# EAGLE design MS_20_Filter_Geetah (EAGLE 9.6.0)
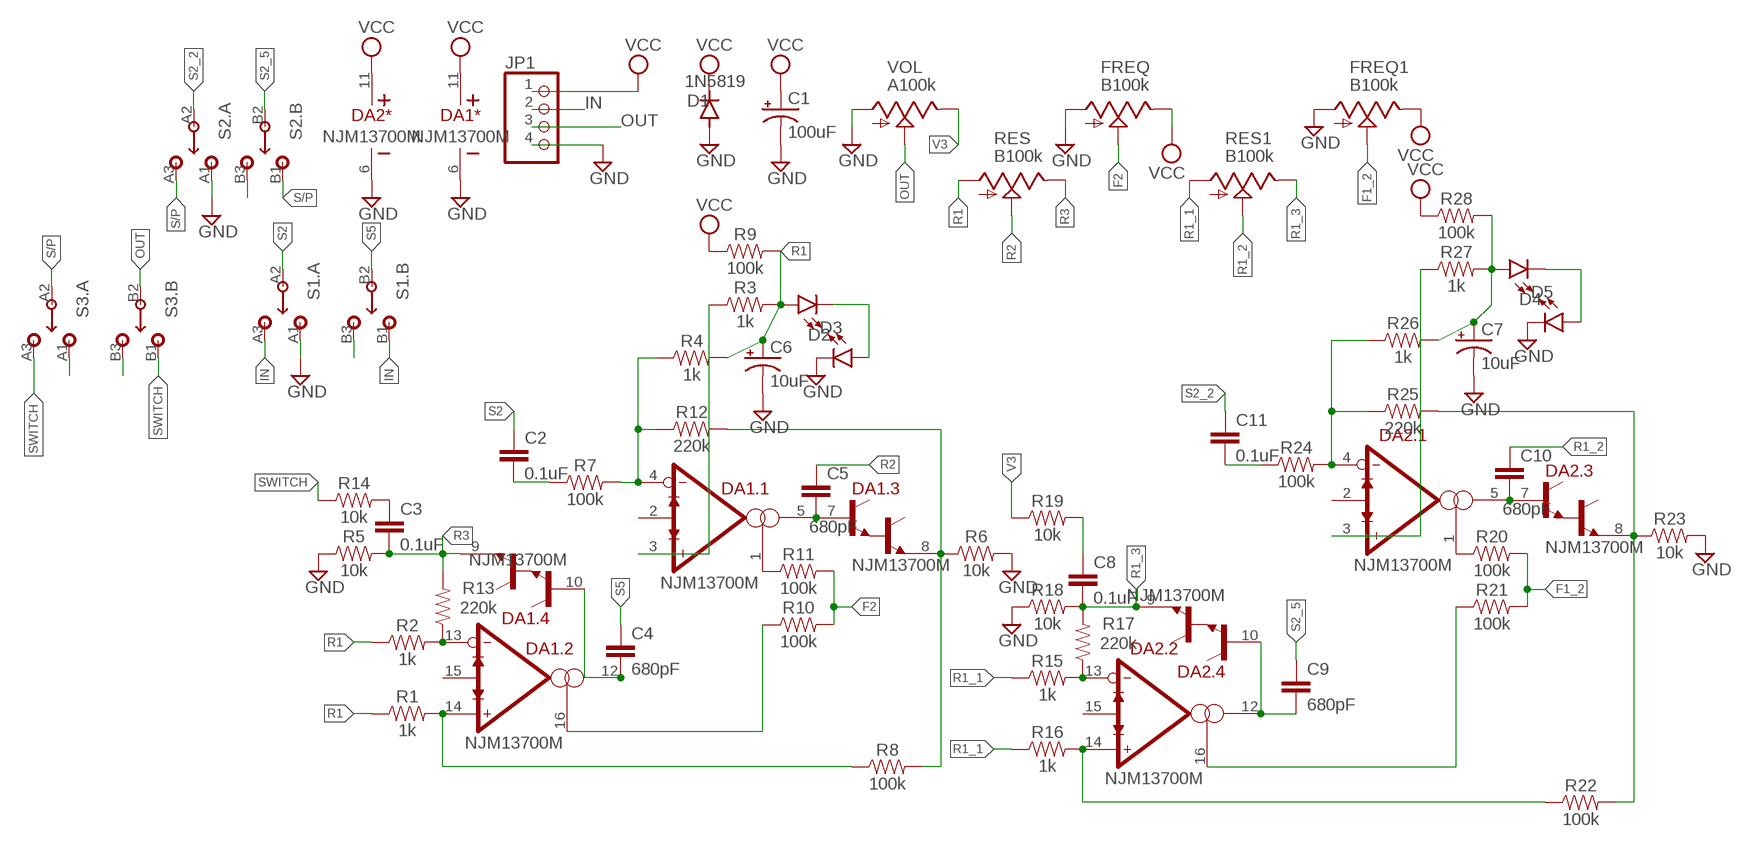
[diagram p0: schematic, sheet 1]

## Parts
C1  100uF  CAP_SMD+THRUPAN_B  [PAN_B_SMD+THRU]
C2  0.1uF  0.1UF-0603-25V-(+80/-20%)  [0603]
C3  0.1uF  0.1UF-0603-25V-(+80/-20%)  [0603]
C4  680pF  680PF-0603-50V-10%  [0603]
C5  680pF  680PF-0603-50V-10%  [0603]
C6  10uF  CAP_SMD+THRUPAN_B  [PAN_B_SMD+THRU]
C7  10uF  CAP_SMD+THRUPAN_B  [PAN_B_SMD+THRU]
C8  0.1uF  0.1UF-0603-25V-(+80/-20%)  [0603]
C9  680pF  680PF-0603-50V-10%  [0603]
C10  680pF  680PF-0603-50V-10%  [0603]
C11  0.1uF  0.1UF-0603-25V-(+80/-20%)  [0603]
D1  1N5819  DIODE-SOD123  [SOD123]
D2  LED-FKIT-1206  [FKIT-LED-1206]
D3  LED-FKIT-1206  [FKIT-LED-1206]
D4  LED-FKIT-1206  [FKIT-LED-1206]
D5  LED-FKIT-1206  [FKIT-LED-1206]
DA1  NJM13700M  [SO-16]
DA2  NJM13700M  [SO-16]
FREQ  B100k  9MM_SNAP-IN_POT_  [9MM_SNAP-IN_POT]
FREQ1  B100k  9MM_SNAP-IN_POT_  [9MM_SNAP-IN_POT]
JP1  PINHD-1X4  [1X04]
R1  1k  1KOHM-0603-1/10W-1%  [0603]
R2  1k  1KOHM-0603-1/10W-1%  [0603]
R3  1k  1KOHM-0603-1/10W-1%  [0603]
R4  1k  1KOHM-0603-1/10W-1%  [0603]
R5  10k  10KOHM-0603-1/10W-1%  [0603]
R6  10k  10KOHM-0603-1/10W-1%  [0603]
R7  100k  100KOHM-0603-1/10W-1%  [0603]
R8  100k  100KOHM-0603-1/10W-1%  [0603]
R9  100k  100KOHM-0603-1/10W-1%  [0603]
R10  100k  100KOHM-0603-1/10W-1%  [0603]
R11  100k  100KOHM-0603-1/10W-1%  [0603]
R12  220k  220KOHM-0603-1/10W-1%  [0603]
R13  220k  220KOHM-0603-1/10W-1%  [0603]
R14  10k  10KOHM-0603-1/10W-1%  [0603]
R15  1k  1KOHM-0603-1/10W-1%  [0603]
R16  1k  1KOHM-0603-1/10W-1%  [0603]
R17  220k  220KOHM-0603-1/10W-1%  [0603]
R18  10k  10KOHM-0603-1/10W-1%  [0603]
R19  10k  10KOHM-0603-1/10W-1%  [0603]
R20  100k  100KOHM-0603-1/10W-1%  [0603]
R21  100k  100KOHM-0603-1/10W-1%  [0603]
R22  100k  100KOHM-0603-1/10W-1%  [0603]
R23  10k  10KOHM-0603-1/10W-1%  [0603]
R24  100k  100KOHM-0603-1/10W-1%  [0603]
R25  220k  220KOHM-0603-1/10W-1%  [0603]
R26  1k  1KOHM-0603-1/10W-1%  [0603]
R27  1k  1KOHM-0603-1/10W-1%  [0603]
R28  100k  100KOHM-0603-1/10W-1%  [0603]
RES  B100k  9MM_SNAP-IN_POT_  [9MM_SNAP-IN_POT]
RES1  B100k  9MM_SNAP-IN_POT_  [9MM_SNAP-IN_POT]
S1  DPDT.LUGS  [DPDT.LUGS]
S2  DPDT.LUGS  [DPDT.LUGS]
S3  DPDT.LUGS  [DPDT.LUGS]
VOL  A100k  9MM_SNAP-IN_POT_  [9MM_SNAP-IN_POT]

## Nets
F1_2: FREQ1.2(S) R20.2 R21.2
F2: FREQ.2(S) R10.2 R11.2
GND: C1.- C1.--(-) C6.- C6.--(-) C7.- C7.--(-) D1.A D3.C D5.C DA1.6(*:V-) DA2.6(*:V-) FREQ1.1(A) FREQ.1(A) JP1.4 R5.1 R6.2 R18.1 R23.2 S1.A1 S2.A1 VOL.1(A)
IN: JP1.2 S1.A3 S1.B1
N$1: C2.2 R7.1
N$2: DA1.4(.1:IN-) R4.1 R7.2 R12.1
N$3: DA1.1(.1:AMP_BIAS) R11.1
N$4: C5.2 DA1.5(.1:OUT) DA1.7(.3:B)
N$5: DA1.8(.3:E) R6.1 R8.2 R12.2
N$6: DA1.3(.1:IN+) R3.1
N$7: DA1.16(.2:AMP_BIAS) R10.1
N$8: D2.C D3.A
N$9: C4.2 DA1.10(.4:B) DA1.12(.2:OUT)
N$10: DA1.13(.2:IN-) R2.2 R13.1
N$11: C3.1 R14.2
N$12: DA1.14(.2:IN+) R1.2 R8.1
N$14: S2.B3
N$15: DA2.13(.2:IN-) R15.2 R17.1
N$16: S1.B3
N$17: DA2.14(.2:IN+) R16.2 R22.1
N$18: S3.A1
N$19: C8.1 R19.2
N$20: DA2.1(.1:AMP_BIAS) R20.1
N$21: C9.2 DA2.10(.4:B) DA2.12(.2:OUT)
N$22: DA2.16(.2:AMP_BIAS) R21.1
N$23: C10.2 DA2.5(.1:OUT) DA2.7(.3:B)
N$24: DA2.8(.3:E) R22.2 R23.1 R25.2
N$25: DA2.4(.1:IN-) R24.2 R25.1 R26.1
N$26: C11.2 R24.1
N$27: S3.B3
N$29: DA2.3(.1:IN+) R27.1
N$30: D4.C D5.A
N$31: C7.+ C7.++(+) D4.A R26.2 R27.2 R28.2
OUT: JP1.3 S3.B2 VOL.2(S)
R1: C6.+ C6.++(+) D2.A R1.1 R2.1 R3.2 R4.2 R9.2 RES.1(A)
R1_1: R15.1 R16.1 RES1.1(A)
R1_2: C10.1 RES1.2(S)
R1_3: C8.2 DA2.9(.4:E) R17.2 R18.2 RES1.3(E)
R2: C5.1 RES.2(S)
R3: C3.2 DA1.9(.4:E) R5.2 R13.2 RES.3(E)
S2: C2.1 S1.A2
S2_2: C11.1 S2.A2
S2_5: C9.1 S2.B2
S5: C4.1 S1.B2
S/P: S2.A3 S2.B1 S3.A2
SWITCH: R14.1 S3.A3 S3.B1
V3: R19.1 VOL.3(E)
VCC: C1.+ C1.++(+) D1.C DA1.11(*:V+) DA2.11(*:V+) FREQ1.3(E) FREQ.3(E) JP1.1 R9.1 R28.1
Unconnected: DA1.2(.1:DIODE_BIAS) DA1.15(.2:DIODE_BIAS) DA2.2(.1:DIODE_BIAS) DA2.15(.2:DIODE_BIAS)

## Library data of the parts
C1 C6 C7 = MusicThingModular:CAP_SMD+THRU
C2 C3 C8 C11 = SparkFun-Capacitors:0.1UF: 0.1µF ceramic capacitors A capacitor is a passive two-terminal electrical component used to store electrical energy temporarily in an electric field.; PROD_ID: CAP-00810
C4 C5 C9 C10 = SparkFun-Capacitors:680PF: 680pF/0.68nF ceramic capacitors A capacitor is a passive two-terminal electrical component used to store electrical energy temporarily in an electric field.; PROD_ID: CAP-09232
D1 = diode:DIODE-: DIODE
D2-D5 = SparkFun-LED:LED: LED (Generic) Standard schematic elements and footprints for 5mm, 3mm, 1206, and 0603 sized LEDs. Generic LEDs with no color specified.
DA1 DA2 = ic-jrc:NJM13700
FREQ FREQ1 RES RES1 VOL = MusicThingModular:9MM_SNAP-IN_POT: 9mm vertical snap-in pot, Alpha / Panasonic style
JP1 = Connector:PINHD-1X4: PIN HEADER; CATEGORY: CONNECTOR; SUB-CATEGORY: PIN-HEADER
R1-R4 R15 R16 R26 R27 = SparkFun-Resistors:1KOHM: 1kΩ resistor A resistor is a passive two-terminal electrical component that implements electrical resistance as a circuit element. Resistors act to reduce current flow, and, at the same time, act to lower voltage levels within circuits. - Wikipedia; PROD_ID: RES-07856
R5 R6 R14 R18 R19 R23 = SparkFun-Resistors:10KOHM: 10kΩ resistor A resistor is a passive two-terminal electrical component that implements electrical resistance as a circuit element. Resistors act to reduce current flow, and, at the same time, act to lower voltage levels within circuits. - Wikipedia; PROD_ID: RES-00824
R7-R11 R20-R22 R24 R28 = SparkFun-Resistors:100KOHM: 100kΩ resistor A resistor is a passive two-terminal electrical component that implements electrical resistance as a circuit element. Resistors act to reduce current flow, and, at the same time, act to lower voltage levels within circuits. - Wikipedia; PROD_ID: RES-07828
R12 R13 R17 R25 = SparkFun-Resistors:220KOHM: 220kΩ resistor A resistor is a passive two-terminal electrical component that implements electrical resistance as a circuit element. Resistors act to reduce current flow, and, at the same time, act to lower voltage levels within circuits. - Wikipedia; PROD_ID: RES-08969
S1-S3 = switches:DPDT: DPDT Switches

## Board
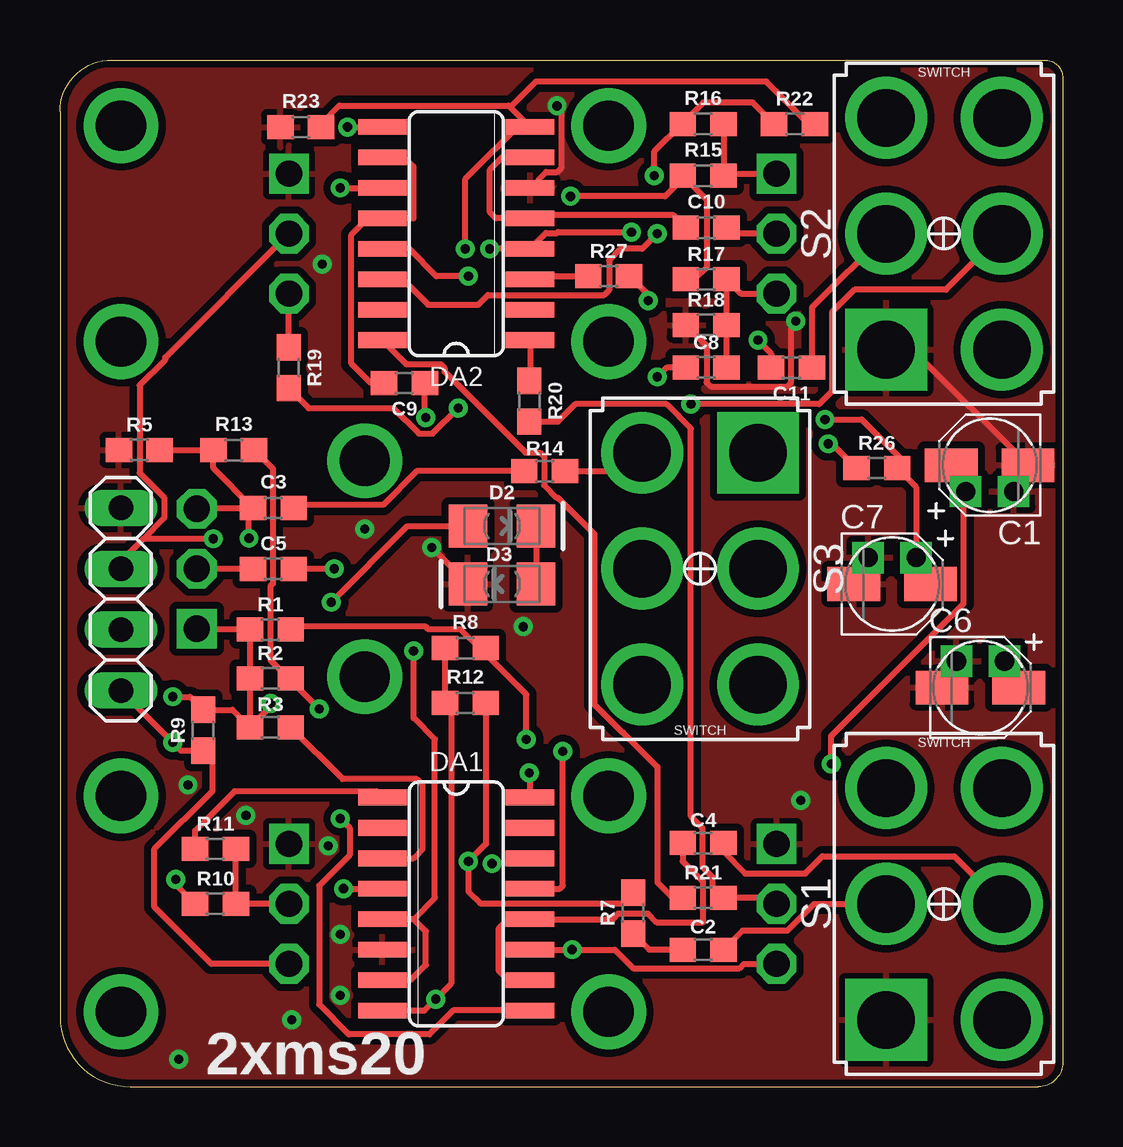
[diagram p1: board, top side]
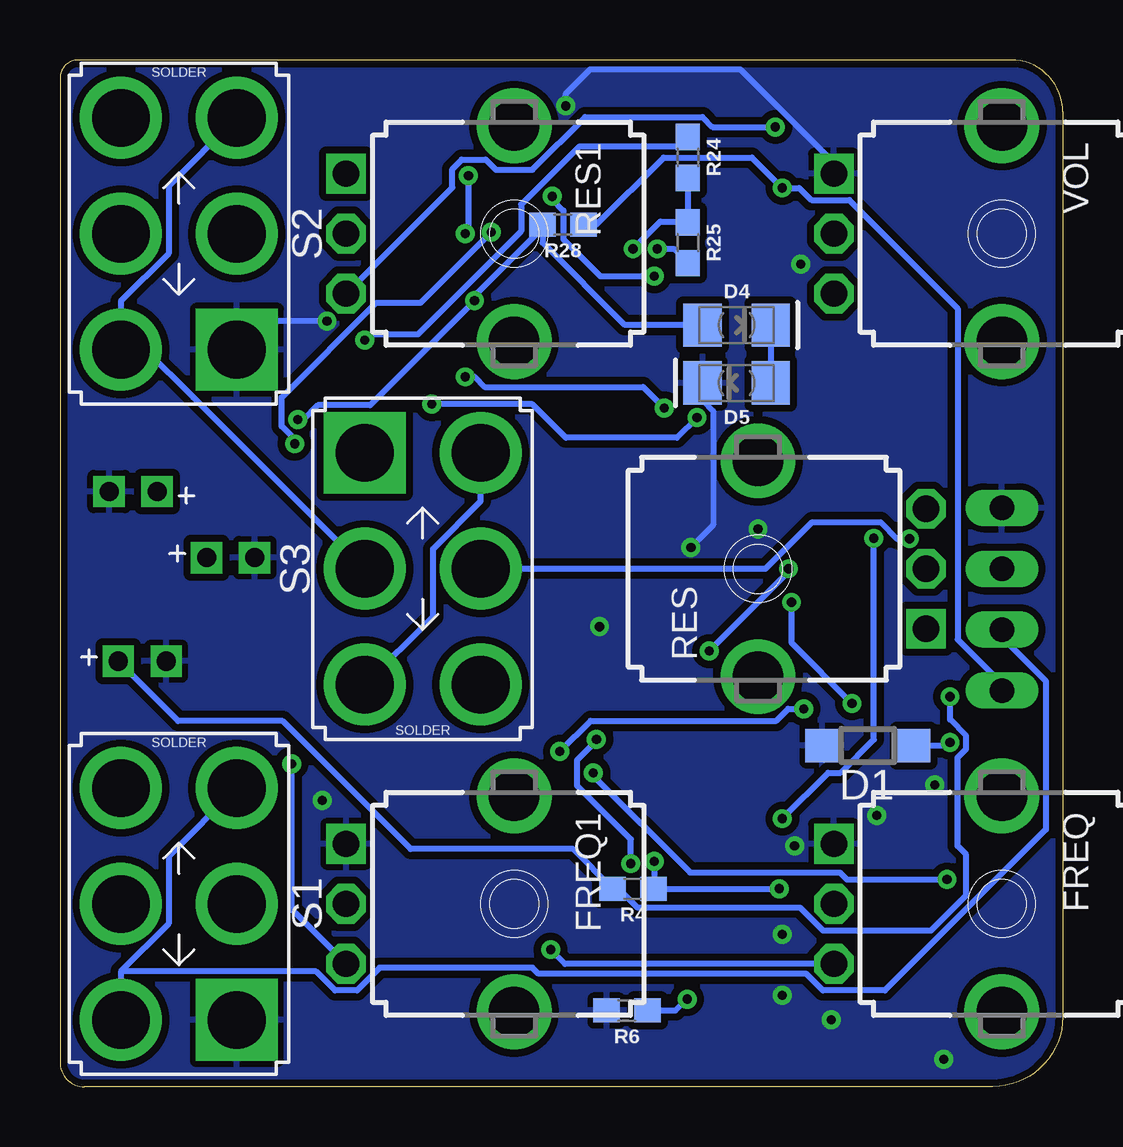
[diagram p2: board, bottom side, seen from below]

Size 41.78 x 42.8 mm. Coordinates in mm from the lower left corner, seen from the top.
Outline: 2.92,0 40.77,0 arc90 41.78,1.02 41.78,42.04 arc90 41.02,42.8 2.16,42.8 arc90 0,40.64 0,2.92 arc90 2.92,0
Copper layers (1*16): Top 0.035mm / dielectric 1.5mm / Bottom 0.035mm
Design rules "default *": minimum track width 6mil, minimum drill 0.35mm, track to track 6mil, track to pad 6mil, pad to pad 6mil, via to via 6mil, smd to smd 6mil, copper to edge 6mil, drill to drill 6mil, minimum pad ring 10mil, minimum via ring 8mil, stop-mask expansion 4mil, vias tented up to drill 0mil, thermal gap 10mil

### Footprints (pad centres in the part's own frame; a part is rotated, then mirrored left to right if it is on the bottom)
PAN_B_SMD+THRU = smd 2.2 x 1.4: + 1.6,0; - -1.6,0 | drill 0.8 pad 0.9 square: ++ 1,1.1; -- -1,1.1
0603 = smd 1.1 x 1: 1 -0.85,0; 2 0.85,0
SOD123 = smd 1.4 x 1.4: A 1.9,0; C -1.9,0
FKIT-LED-1206 = smd 1.6 x 1.803: A -1.422,0; C 1.422,0
SO-16 = smd 0.66 x 2.032: 1 -4.445,-3.073; 2 -3.175,-3.073; 3 -1.905,-3.073; 4 -0.635,-3.073; 5 0.635,-3.073; 6 1.905,-3.073; 7 3.175,-3.073; 8 4.445,-3.073; 9 4.445,3.073; 10 3.175,3.073; 11 1.905,3.073; 12 0.635,3.073; 13 -0.635,3.073; 14 -1.905,3.073; 15 -3.175,3.073; 16 -4.445,3.073
9MM_SNAP-IN_POT = drill 1.1 square: 1 -2.5,-7 | drill 1.1 octagon: 2 0,-7; 3 2.5,-7 | drill 2.1 pad 2.794: CHASSIS1 -4.5,0; CHASSIS2 4.5,0
1X04 = drill 1.016 long: 1 -3.81,0; 2 -1.27,0; 3 1.27,0; 4 3.81,0
DPDT.LUGS = drill 2.4 square: A1 -2.413,4.834 | drill 2.4: A2 -2.413,0.004; A3 -2.413,-4.826; B1 2.417,4.834; B2 2.417,0.004; B3 2.417,-4.826

### Placement (x,y rotation side)
C1  38.73,25.91 180 top
C2  26.8,5.71 180 top
C3  8.89,24.13 180 top
C4  26.8,10.16 180 top
C5  8.89,21.59 0 top
C6  38.35,16.64 0 top
C7  34.67,20.95 0 top
C8  26.92,29.97 0 top
C9  14.35,29.34 180 top
C10  26.92,35.81 180 top
C11  30.48,29.97 180 top
D1  8.13,14.22 180 bottom
D2  18.41,23.37 0 top
D3  18.41,20.95 180 top
D4  13.59,31.75 0 bottom
D5  13.59,29.34 180 bottom
DA1  16.51,7.62 270 top
DA2  16.51,35.56 90 top
FREQ  2.54,7.62 270 bottom
FREQ1  22.86,7.62 270 bottom
JP1  2.54,20.32 90 top
R1  8.76,19.05 0 top
R2  8.76,17.02 0 top
R3  8.76,14.99 180 top
R4  17.91,8.26 180 bottom
R5  3.3,26.54 0 top
R6  18.16,3.17 180 bottom
R7  23.88,7.24 90 top
R8  16.89,18.29 180 top
R9  5.97,14.86 90 top
R10  6.48,7.62 0 top
R11  6.48,9.91 0 top
R12  16.89,16 180 top
R13  7.24,26.54 180 top
R14  20.19,25.65 180 top
R15  26.8,37.97 180 top
R16  26.8,40.13 180 top
R17  26.92,33.66 0 top
R18  26.92,31.75 0 top
R19  9.53,29.97 270 top
R20  19.56,28.57 270 top
R21  26.8,7.87 0 top
R22  30.61,40.13 0 top
R23  10.03,40.01 180 top
R24  15.62,38.73 270 bottom
R25  15.62,35.18 270 bottom
R26  34.04,25.78 0 top
R27  22.86,33.78 0 top
R28  20.83,35.94 180 bottom
RES  12.7,21.59 90 bottom
RES1  22.86,35.56 270 bottom
S1  36.83,7.62 180 bottom
S2  36.83,35.56 180 bottom
S3  26.67,21.59 0 bottom
VOL  2.54,35.56 270 bottom

### Tracks (layer width: path | path; a pad name or v marks a point on that pad's centre or on a via)
F1_2
  Top 0.254: FREQ1.2 29.61,7.87 R21.2 27.2,8.32 27.2,8.72 26.78,9.14 26.78,10.78 26.29,11.26 26.29,27.43 25.27,28.45 21.46,28.45 20.74,27.73 R20.2
F2
  Top 0.254: FREQ.2 R10.2 R11.2
GND  (via drill 0.38)
  Top 0.254: v15.49,22.48 16.99,20.98 D3.C | S2.A1 35.52,30.73 C1.- 40.34,25.41 C1.-- | R18.1 26.95,30.88 26.95,29.36 27.11,29.19 30.3,29.19 30.46,29.36 30.46,31.72 v30.66,31.92 | DA2.6 20.24,38.12 20.71,38.12 20.88,38.29 20.88,40.72 v20.71,40.88
  Bottom 0.254: D5.C 15.01,28.61 14.57,28.17 14.57,23.41 v15.49,22.48 | v30.66,31.92 33.23,31.92 S2.A1 | VOL.1 9.54,38.52 13.43,42.41 19.69,42.41 20.71,41.39 v20.71,40.88
  other vias: 4.95,1.14 7.75,11.3 10.92,34.29 12.7,23.24 30.86,11.94 9.65,2.79 11.68,6.35 5.33,12.57 11.18,10.03 19.3,19.18 11.68,3.81
  pour Top (isolate 0.305): -0.64,43.18 -0.64,-0.64 -0.51,-0.76 42.16,-0.76 42.55,-0.38 42.55,43.05 42.04,43.56 -0.25,43.56
  pour Bottom (isolate 0.305): -0.51,43.43 -0.51,-0.76 41.91,-0.76 42.55,-0.13 42.55,42.8 41.78,43.56 -0.38,43.56
IN
  Bottom 0.254: S1.A3 37.26,9.6 37.26,6.79 39.25,4.8 | 39.25,4.8 S1.B1 | 39.25,4.8 31.11,4.8 30.32,4.02 29.4,4.02 28.46,4.96 22.1,4.96 21.86,4.71 10.7,4.71 10,4.02 7.41,4.02 0.7,10.72 0.7,16.91 2.54,18.75 JP1.2
N$1
  Top 0.254: C2.2 24.55,5.71 R7.1
N$2  (via drill 0.38)
  Top 0.254: v11.81,8.26 DA1.4 | R12.1 17.74,10.12 v17.02,9.4 17.02,8.13 17.5,7.64 23.43,7.64 R7.2
  Bottom 0.254: v11.81,8.26 R4.1 17.02,8.29 v17.02,9.4
N$3
  Top 0.254: DA1.1 13.18,12.32 7.28,12.32 5.63,10.67 R11.1
N$4  (via drill 0.38)
  Top 0.254: DA1.7 14.61,4.45 15.24,5.08 15.24,6.48 14.73,6.99 | 14.73,6.99 DA1.5 | 14.73,6.99 15.62,7.87 15.62,14.48 14.73,15.37 v14.73,18.16 | v11.43,21.59 C5.2
  Bottom 0.254: v14.73,18.16 11.43,21.46 v11.43,21.59
N$5  (via drill 0.38)
  Top 0.254: R8.2 R12.2 16.3,15.75 16.3,4.29 v15.65,3.65 15.18,3.17 DA1.8
  Bottom 0.254: R6.1 16.13,3.17 v15.65,3.65
N$6
  Top 0.254: DA1.3 14.73,9.53 15.11,9.91 15.11,12.57 14.86,12.83 11.77,12.83 R3.1
N$7  (via drill 0.38)
  Top 0.254: DA1.16 19.58,13.06 v19.56,13.08 | v4.83,8.64 4.83,8.42 R10.1
  Bottom 0.254: v4.83,8.64 8.99,8.64 9.29,8.93 15.53,8.93 19.56,12.95 v19.56,13.08
N$8
  Top 0.254: D2.C D3.A
N$9
  Top 0.254: C4.2 25.95,9.4 26.8,8.55 26.8,6.86 24.85,6.86 24.49,7.22 23.26,7.22 23.03,6.99 DA1.12 18.67,6.99 18.29,6.6 18.29,4.83 18.67,4.45 DA1.10
N$10  (via drill 0.38)
  Top 0.254: DA1.13 20.83,8.26 20.95,8.38 v20.95,13.97 | v10.79,15.75 9.61,16.93 | 9.61,16.93 R2.2 | R13.1 8.87,25.76 8.87,20.97 8.76,20.87 8.76,17.78 9.61,16.93
  Bottom 0.254: v10.79,15.75 11.44,15.75 11.94,15.25 19.67,15.25 v20.95,13.97
N$11
  Top 0.254: R14.2 14.86,25.65 13.46,24.25 9.86,24.25 C3.1
N$12  (via drill 0.38)
  Top 0.254: R8.1 17.49,18.29 | 17.49,18.29 16.71,19.07 15.35,19.07 15.24,19.18 9.74,19.18 R1.2 | DA1.14 19.36,9.3 v18,9.3 | v19.43,14.48 19.43,16.34 17.49,18.29
  Bottom 0.254: v18,9.3 18,10.32 20.23,12.55 20.23,13.61 19.43,14.41 v19.43,14.48
N$15  (via drill 0.38)
  Top 0.254: v21.27,37.11 25.21,37.11 25.95,37.85 R15.2 26.95,36.98 26.95,34.16 26.44,33.66 R17.1 | DA2.13 14.54,34.92 15.69,33.78 v17.02,33.78
  Bottom 0.254: v21.27,37.11 21.27,36.99 20.81,36.52 20.81,35.33 19.26,33.78 v17.02,33.78
N$17  (via drill 0.38)
  Top 0.254: v24.89,35.56 24.26,34.92 23.37,34.92 22.88,34.44 22.88,33.21 22.68,33 17.83,33 17.42,32.6 15.34,32.6 14.29,33.66 DA2.14 | R16.2 25.91,40.13 | v24.77,37.97 24.77,38.99 25.91,40.13 | R22.1 28.87,41.02 26.8,41.02 25.91,40.13
  Bottom 0.254: v24.89,35.56 24.77,35.69 v24.77,37.97
N$19  (via drill 0.38)
  Top 0.254: R19.2 10.36,28.29 13.89,28.29 14.96,27.22 15.52,27.22 16.59,28.29 v16.6,28.29 | v24.89,29.59 25.27,29.97 C8.1
  Bottom 0.254: v16.6,28.29 17.49,29.17 24.09,29.17 24.51,29.59 v24.89,29.59
N$20
  Top 0.254: DA2.1 19.58,29.45 R20.1
N$21
  Top 0.254: DA2.10 14.35,38.73 14.73,38.35 14.73,36.2 DA2.12 12.83,36.2 12.14,35.51 12.14,30.15 12.95,29.34 C9.2
N$22
  Top 0.254: DA2.16 14.44,30.12 15.87,30.12 16.03,29.95 16.03,29.81 19.4,26.43 20.01,26.43 20.17,26.27 20.17,25.08 20.7,24.55 20.75,24.55 22.27,23.04 22.27,15.94 23.43,14.78 23.45,14.78 24.89,13.34 24.89,8.51 25.53,7.87 R21.1
N$23
  Top 0.254: C10.2 25.57,36.32 19.71,36.32 DA2.5 18.16,36.2 17.91,36.45 17.91,38.23 18.41,38.73 DA2.7
N$24  (via drill 0.38)
  Top 0.254: R23.1 10.88,40.13 11.64,40.89 18.69,40.89 19.32,40.27 | 19.32,40.27 DA2.8 18.76,40.83 19.82,41.9 29.44,41.9 31.2,40.13 R22.2 | 19.32,40.27 16.89,37.85 v16.89,34.92
  Bottom 0.254: v16.89,34.92 16.22,34.92 R25.2
N$25  (via drill 0.38)
  Top 0.254: v17.91,34.92 DA2.4 20.24,35.59 20.71,35.59 20.75,35.62 v23.81,35.62 | v32,26.8 32.17,26.8 R26.1
  Bottom 0.254: R24.2 15.62,36.07 | 15.62,36.07 R25.1 | v17.91,34.92 16.76,36.07 15.62,36.07 | v23.81,35.62 26.76,32.68 28.6,32.68 32.55,28.73 32.55,27.53 32,26.99 v32,26.8
N$26  (via drill 0.38)
  Top 0.254: v29.08,31.11 29.63,30.57 C11.2
  Bottom 0.254: v29.08,31.11 28.83,31.37 26.86,31.37 22.57,35.66 22.57,36.77 20.14,39.2 16,39.2 R24.1
N$29
  Top 0.254: DA2.3 19.71,33.78 R27.1
N$30
  Bottom 0.254: D4.C D5.A
N$31  (via drill 0.38)
  Top 0.254: R26.2 35.03,25.63 | 35.03,25.63 35.67,25 C7.++ 36.27,21.45 C7.+ | v24.51,32.77 24.51,33.02 23.84,33.69 23.8,33.69 R27.2 | v31.88,27.81 33.4,27.81 35.03,26.18 35.03,25.63
  Bottom 0.254: D4.A 18.25,31.75 21.68,35.18 R28.2 21.68,35.81 24.51,32.98 v24.51,32.77 28.87,28.41 31.03,28.41 31.63,27.81 v31.88,27.81
OUT  (via drill 0.38)
  Top 0.254: VOL.2 4.38,30.4 4.38,30.3 3.32,29.24 3.32,25.58 4.34,24.56 4.34,23.7 3.48,22.84 | JP1.3 2.54,21.89 3.4,22.76 3.48,22.84 | v6.39,22.84 3.48,22.84
  Bottom 0.254: S3.B2 12.38,21.59 10.44,23.53 7.59,23.53 6.9,22.84 v6.39,22.84
R1  (via drill 0.38)
  Top 0.254: C6.+ 39.35,17.24 C6.++ | R3.2 7.19,15.71 R9.2 5.42,16.26 v4.7,16.26 | R3.2 R2.1 R1.1 5.74,19.05 RES.1 | R3.2 8.79,15.86 v8.79,15.98 | v11.3,20.19 14.48,23.37 D2.A
  Bottom 0.254: C6.++ 36.86,15.24 32.51,15.24 27.18,9.91 20.41,9.91 R4.2 18.5,8.26 17.72,7.48 10.96,7.48 10,6.52 5.49,6.52 4.03,7.98 4.03,9.68 4.38,10.03 4.38,13.72 4.03,14.07 4.03,14.63 4.7,15.3 v4.7,16.26 | v8.79,15.98 11.3,18.5 v11.3,20.19
R1_1
  Top 0.254: R16.1 R15.1 27.73,38.06 RES1.1
R1_2
  Top 0.254: RES1.2 28.03,35.56 C10.1
R1_3  (via drill 0.38)
  Top 0.254: RES1.3 28.37,33.06 R17.2 R18.2 C8.2 | v11.98,40.01 DA2.9
  Bottom 0.254: v11.98,40.01 14.6,40.01 15.01,40.41 19.91,40.41 22.1,38.22 23.62,38.22 24.05,38.65 25.04,38.65 25.44,38.25 25.44,37.48 RES1.3
R2
  Top 0.254: C5.1 RES.2
R3  (via drill 0.38)
  Top 0.254: RES.3 5.74,24.13 7.87,24.13 | 7.87,24.13 C3.2 6.39,25.78 R13.2 R5.2 | DA1.9 16.38,3.17 15.39,2.18 12.04,2.18 10.79,3.43 10.79,8.38 12.06,9.65 12.06,10.79 v11.68,11.18 | v7.87,22.86 7.87,24.13
  Bottom 0.254: v11.68,11.18 9.78,13.08 9.26,13.08 7.87,14.47 v7.87,22.86
S2
  Top 0.254: C2.1 28.45,6.52 30.32,6.52 31.42,7.62 S1.A2
S2_2
  Top 0.254: S2.A2 31.33,32.47 C11.1
S2_5  (via drill 0.38)
  Top 0.254: S2.B2 36.91,33.22 33.1,33.22 32.16,32.28 32.16,28.98 31.63,28.45 v26.29,28.45 | v15.24,27.89 15.2,27.93 C9.1
  Bottom 0.254: v15.24,27.89 16.08,27.05 20.7,27.05 22.1,28.45 v26.29,28.45
S5
  Top 0.254: C4.1 27.65,9.78 28.54,8.89 31.05,8.89 31.77,9.6 37.26,9.6 S1.B2
S/P
  Bottom 0.254: S2.A3 37.26,37.54 37.26,34.73 39.25,32.74 S2.B1 38.23,30.73 36.24,28.74 36.23,28.74 33.15,25.66 S3.A2
SWITCH
  Top 0.254: R14.1 23.48,25.65 S3.B1
  Bottom 0.254: S3.A3 26.24,19.61 26.24,22.42 24.25,24.41 S3.B1
V3
  Top 0.254: R19.1 9.53,33.05 VOL.3
VCC  (via drill 0.38)
  Top 0.254: DA1.11 v21.34,5.71 23.11,5.71 23.88,4.94 28.31,4.94 28.5,5.12 FREQ1.3 | JP1.1 v4.7,14.35 5.04,14.01 R9.1 6.35,13.63 6.35,12.32 3.94,9.91 3.94,7.49 6.31,5.12 FREQ.3 | v11.68,37.47 DA2.11 | v32.13,13.46 32.13,14.62 37.65,20.14 37.65,24.72 C1.++ 37.73,25.31 C1.+
  Bottom 0.254: D1.C 4.83,14.22 v4.7,14.35 | R28.1 19.43,35.94 16.64,38.73 12.95,38.73 v11.68,37.47 10.99,37.47 10.48,36.96 8.89,36.96 4.38,32.44 4.38,18.65 2.54,16.82 JP1.1 | FREQ.3 20.74,5.12 v21.34,5.71 | FREQ1.3 32.13,7.39 v32.13,13.46

### Text on the board
tPlace: 2xms20